# Altium schematic sheet MCU.schdoc
size B; DocumentFullName: Microcontroller; Organization: Reclaimer Labs, LLC; Address1: 3652 Beth Ct; Address2: Santa Clara CA 95054; DocumentNumber: 2; SheetNumber: 2; SheetTotal: 3; License: Open Source Hardware - MIT License
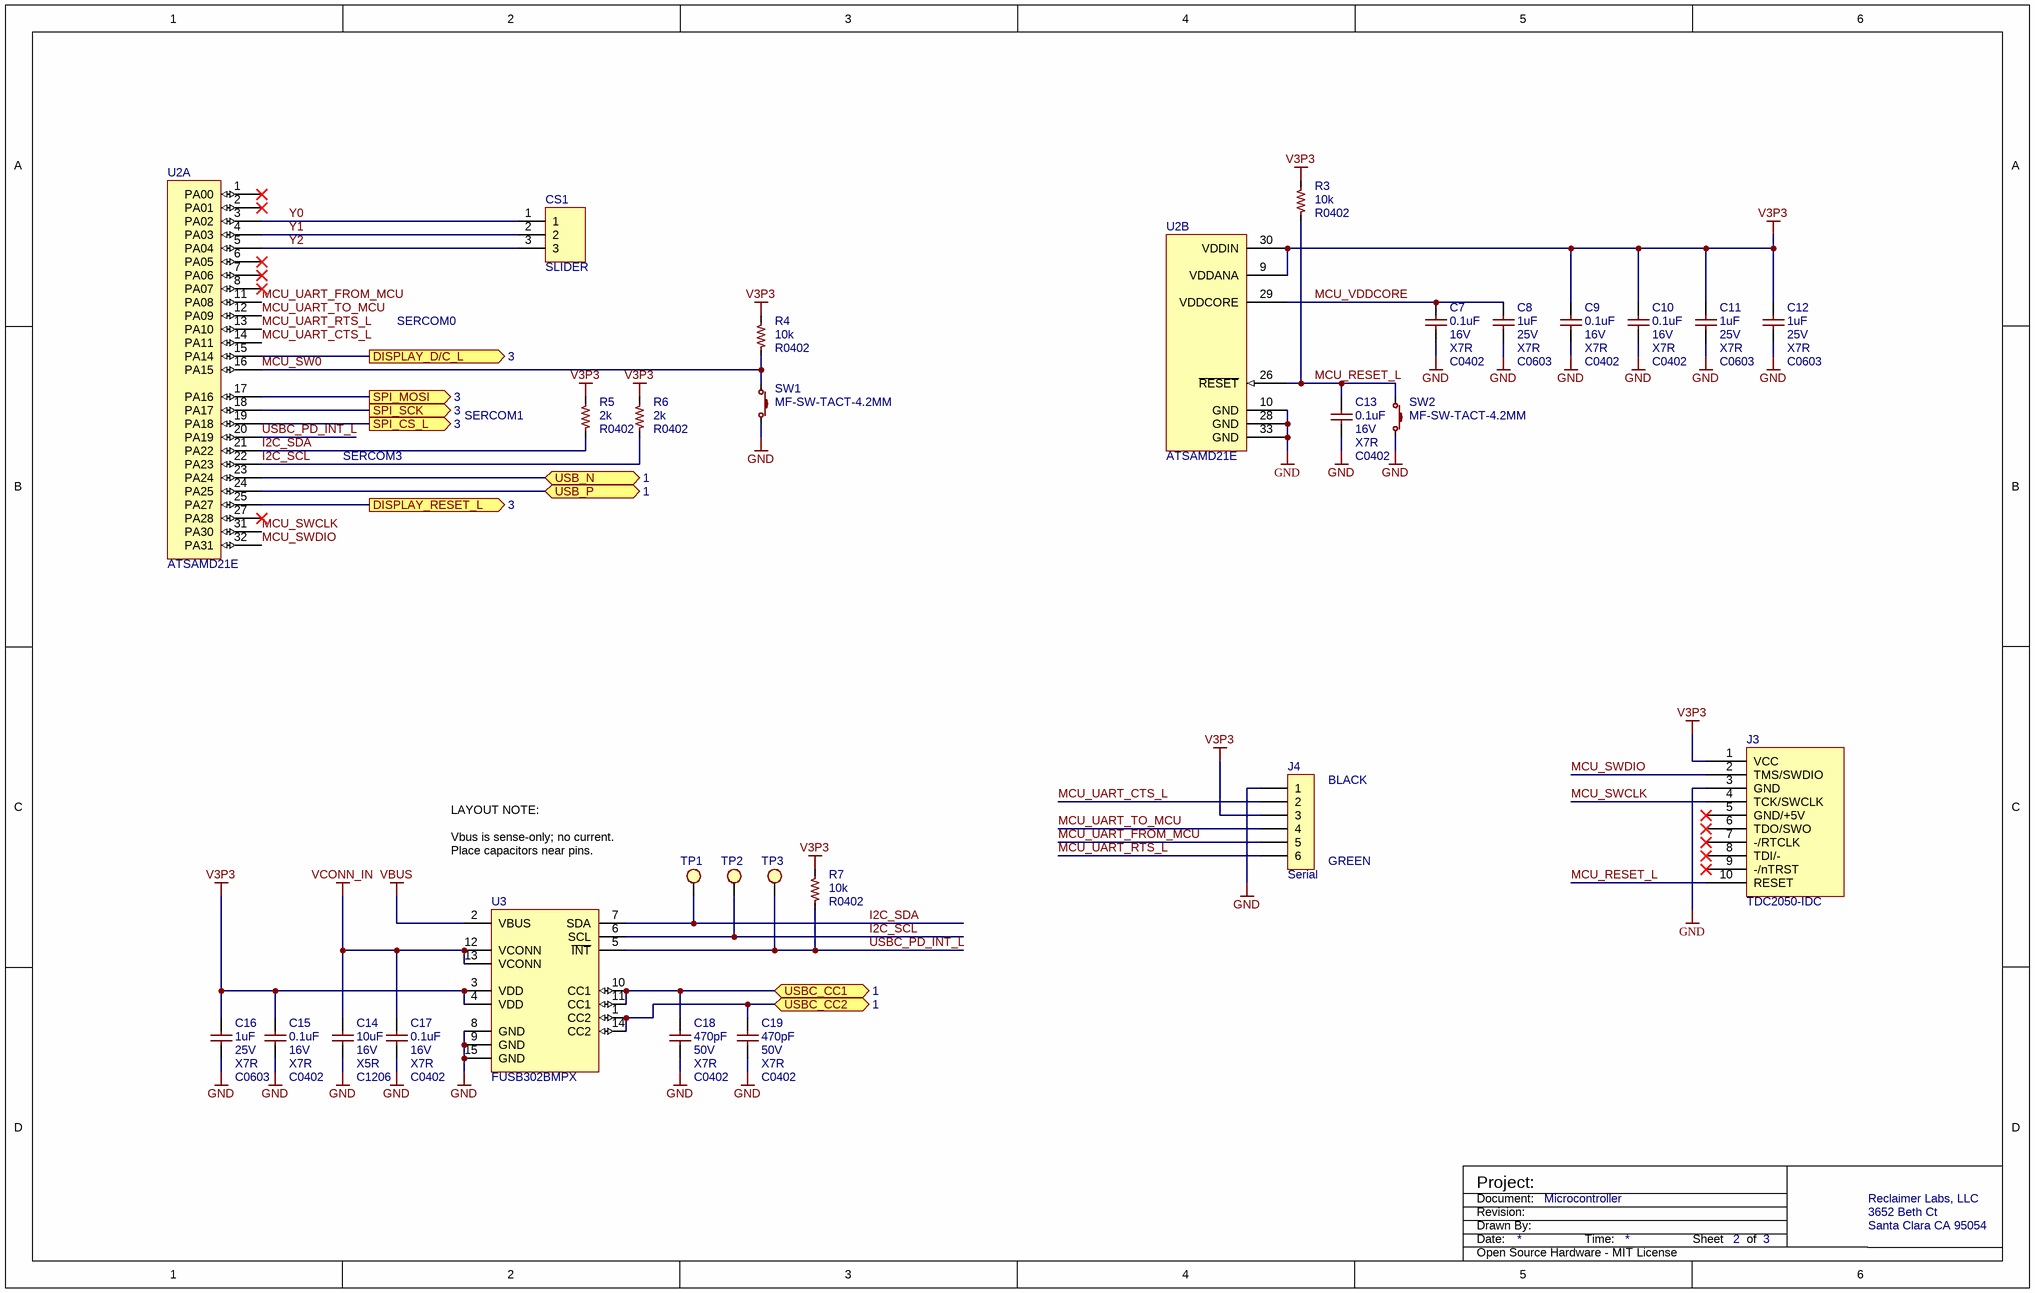
[diagram p0: MCU.schdoc]

## Parts
C7  value 0.1uF  Voltage: 16V  Material: X7R  [C0402]  (hidden comment: MF-CAP-0402-0.1uF)
C8  value 1uF  Voltage: 25V  Material: X7R  [C0603]  (hidden comment: MF-CAP-0603-1uF)
C9  value 0.1uF  Voltage: 16V  Material: X7R  [C0402]  (hidden comment: MF-CAP-0402-0.1uF)
C10  value 0.1uF  Voltage: 16V  Material: X7R  [C0402]  (hidden comment: MF-CAP-0402-0.1uF)
C11  value 1uF  Voltage: 25V  Material: X7R  [C0603]  (hidden comment: MF-CAP-0603-1uF)
C12  value 1uF  Voltage: 25V  Material: X7R  [C0603]  (hidden comment: MF-CAP-0603-1uF)
C13  value 0.1uF  Voltage: 16V  Material: X7R  [C0402]  (hidden comment: MF-CAP-0402-0.1uF)
C14  value 10uF  Voltage: 16V  Material: X5R  [C1206]  (hidden comment: MF-CAP-1206-10uF)
C15  value 0.1uF  Voltage: 16V  Material: X7R  [C0402]  (hidden comment: MF-CAP-0402-0.1uF)
C16  value 1uF  Voltage: 25V  Material: X7R  [C0603]  (hidden comment: MF-CAP-0603-1uF)
C17  value 0.1uF  Voltage: 16V  Material: X7R  [C0402]  (hidden comment: MF-CAP-0402-0.1uF)
C18  value 470pF  Voltage: 50V  Material: X7R  [C0402]  (hidden comment: CL05B471KB5NNNC)
C19  value 470pF  Voltage: 50V  Material: X7R  [C0402]  (hidden comment: CL05B471KB5NNNC)
CS1  SLIDER  [QTOUCH_SLIDER_19x6mm]  (no BOM)
J3  value TDC2050-IDC  [TC2050-IDC-NL]  (hidden comment: DNP)  (no BOM)
J4  value Serial  [CONN_HEADER_01x06_2mm54_Straight]  (hidden comment: DNP)
R3  value 10k  [R0402]  (hidden comment: MF-RES-0402-10K)
R4  value 10k  [R0402]  (hidden comment: MF-RES-0402-10K)
R5  value 2k  [R0402]  (hidden comment: MF-RES-0402-2K)
R6  value 2k  [R0402]  (hidden comment: MF-RES-0402-2K)
R7  value 10k  [R0402]  (hidden comment: MF-RES-0402-10K)
SW1  MF-SW-TACT-4.2MM  [TACT_4.2MM]
SW2  MF-SW-TACT-4.2MM  [TACT_4.2MM]
TP1  TESTPOINT  [TP_1mm]  (value not drawn)  (no BOM)
TP2  TESTPOINT  [TP_1mm]  (value not drawn)  (no BOM)
TP3  TESTPOINT  [TP_1mm]  (value not drawn)  (no BOM)
U2  value ATSAMD21E  [QFN32EP]  (hidden comment: ATSAMD21E17A-MU)  (parts A,B of 2)
U3  FUSB302BMPX  [MLP14]

## Ports
DISPLAY_D/C_L (out, see 3), DISPLAY_RESET_L (out, see 3), SPI_CS_L (out, see 3), SPI_MOSI (out, see 3), SPI_SCK (out, see 3), USB_N (bidir, see 1), USB_P (bidir, see 1), USBC_CC1 (bidir, see 1), USBC_CC2 (bidir, see 1)

## Nets
GND: C7.2(C2) C8.2(C2) C9.2(C2) C10.2(C2) C11.2(C2) C12.2(C2) C13.2(C2) C14.2(C2) C15.2(C2) C16.2(C2) C17.2(C2) C18.2(C2) C19.2(C2) J3.3(GND) J4.1 SW1.2 SW2.2 U2.10(GND) U2.28(GND) U2.33(GND) U3.8(GND) U3.9(GND) U3.15(GND)
V3P3: C9.1(C1) C10.1(C1) C11.1(C1) C12.1(C1) C15.1(C1) C16.1(C1) J3.1(VCC) J4.3 R3.1(R1) R4.1(R1) R5.1(R1) R6.1(R1) R7.1(R1) U2.9(VDDANA) U2.30(VDDIN) U3.3(VDD) U3.4(VDD)
VBUS: U3.2(VBUS)
VCONN_IN: C14.1(C1) C17.1(C1) U3.12(VCONN) U3.13(VCONN)
DISPLAY_D/C_L: U2.15(PA14) ; port DISPLAY_D/C_L
DISPLAY_RESET_L: U2.25(PA27) ; port DISPLAY_RESET_L
I2C_SCL: R6.2(R2) TP2.1 U2.22(PA23) U3.6(SCL)
I2C_SDA: R5.2(R2) TP1.1 U2.21(PA22) U3.7(SDA)
MCU_RESET_L: C13.1(C1) J3.10(RESET) R3.2(R2) SW2.1 U2.26(~{RESET})
MCU_SW0: R4.2(R2) SW1.1 U2.16(PA15)
MCU_SWCLK: J3.4(TCK/SWCLK) U2.31(PA30)
MCU_SWDIO: J3.2(TMS/SWDIO) U2.32(PA31)
MCU_UART_CTS_L: J4.2 U2.14(PA11)
MCU_UART_FROM_MCU: J4.5 U2.11(PA08)
MCU_UART_RTS_L: J4.6 U2.13(PA10)
MCU_UART_TO_MCU: J4.4 U2.12(PA09)
MCU_VDDCORE: C7.1(C1) C8.1(C1) U2.29(VDDCORE)
SPI_CS_L: U2.19(PA18) ; port SPI_CS_L
SPI_MOSI: U2.17(PA16) ; port SPI_MOSI
SPI_SCK: U2.18(PA17) ; port SPI_SCK
USB_N: U2.23(PA24) ; port USB_N
USB_P: U2.24(PA25) ; port USB_P
USBC_CC1: C18.1(C1) U3.10(CC1) U3.11(CC1) ; port USBC_CC1
USBC_CC2: C19.1(C1) U3.1(CC2) U3.14(CC2) ; port USBC_CC2
USBC_PD_INT_L: R7.2(R2) TP3.1 U2.20(PA19) U3.5(~{INT})
Y0: CS1.1 U2.3(PA02)
Y1: CS1.2 U2.4(PA03)
Y2: CS1.3 U2.5(PA04)

Not connected (* = marked no-connect by the designer): J3 5(GND/+5V)* 6(TDO/SWO)* 7(-/RTCLK)* 8(TDI/-)* 9(-/nTRST)*; U2 1(PA00)* 2(PA01)* 6(PA05)* 7(PA06)* 8(PA07)* 27(PA28)*

## Notes on the sheet
- SERCOM0
- SERCOM1
- SERCOM3
- (near J4) BLACK
- LAYOUT NOTE:
  Vbus is sense-only; no current.
  Place capacitors near pins.
- (near J4) GREEN
- Project:
- Date:
- Revision:
- Drawn By:
- Document:
- Time:
- Sheet
- of

## Library data of the parts
C7-C17 = CAPACITOR_NP: Manufacturer 1: MacroFab
  C7 C9 C10 C13 C15 C17: Manufacturer Part Number 1: MF-CAP-0402-0.1uF; DisplayFootprint: C0402
  C8 C11 C12 C16: Manufacturer Part Number 1: MF-CAP-0603-1uF; DisplayFootprint: C0603
  C14: Manufacturer Part Number 1: MF-CAP-1206-10uF; DisplayFootprint: C1206
C18 C19 = CAPACITOR_NP: Manufacturer 1: Samsung; Supplier 1: Digi-Key; Supplier Part Number 1: 1276-1566-1-ND; Manufacturer Part Number 1: CL05B471KB5NNNC; DisplayFootprint: C0402
CS1 = QTOUCH_SLIDER
J3 = TC2050-IDC: Manufacturer Part Number 1: DNP
J4 = CONN_HEADER_01x06_2mm54_Straight: Manufacturer Part Number 1: DNP
R3-R7 = RESISTOR: Manufacturer 1: MacroFab; FootprintDisplay: R0402
  R3 R4 R7: Manufacturer Part Number 1: MF-RES-0402-10K
  R5 R6: Manufacturer Part Number 1: MF-RES-0402-2K
SW1 SW2 = SW_SPST_PB: Manufacturer 1: MacroFab; Value: Push Button; Manufacturer Part Number 1: MF-SW-TACT-4.2MM
U2 = ATSAMD21E: Manufacturer 1: Microchip; Manufacturer Part Number 1: ATSAMD21E17A-MU
U3 = FUSB302B: Manufacturer 1: Fairchild/ON; Value: FUSB302BMPX; Supplier 1: Digi-Key; Supplier Part Number 1: FUSB302BMPXCT-ND; Manufacturer Part Number 1: FUSB302BMPX